# EAGLE design musicbox (EAGLE 7.2.0)
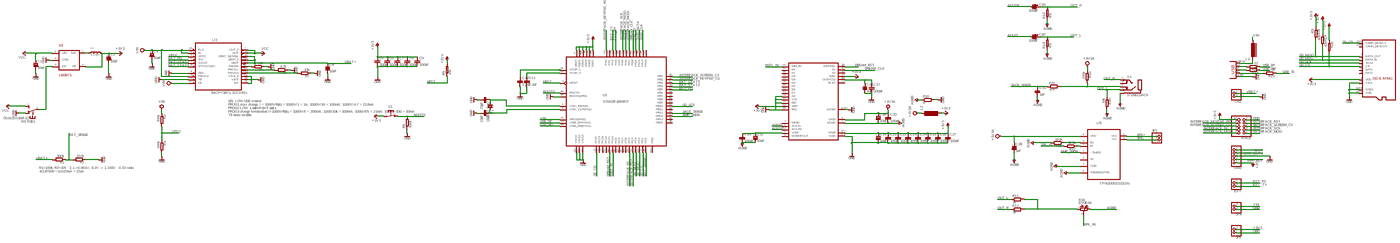
[diagram p0: schematic, sheet 1, overview]
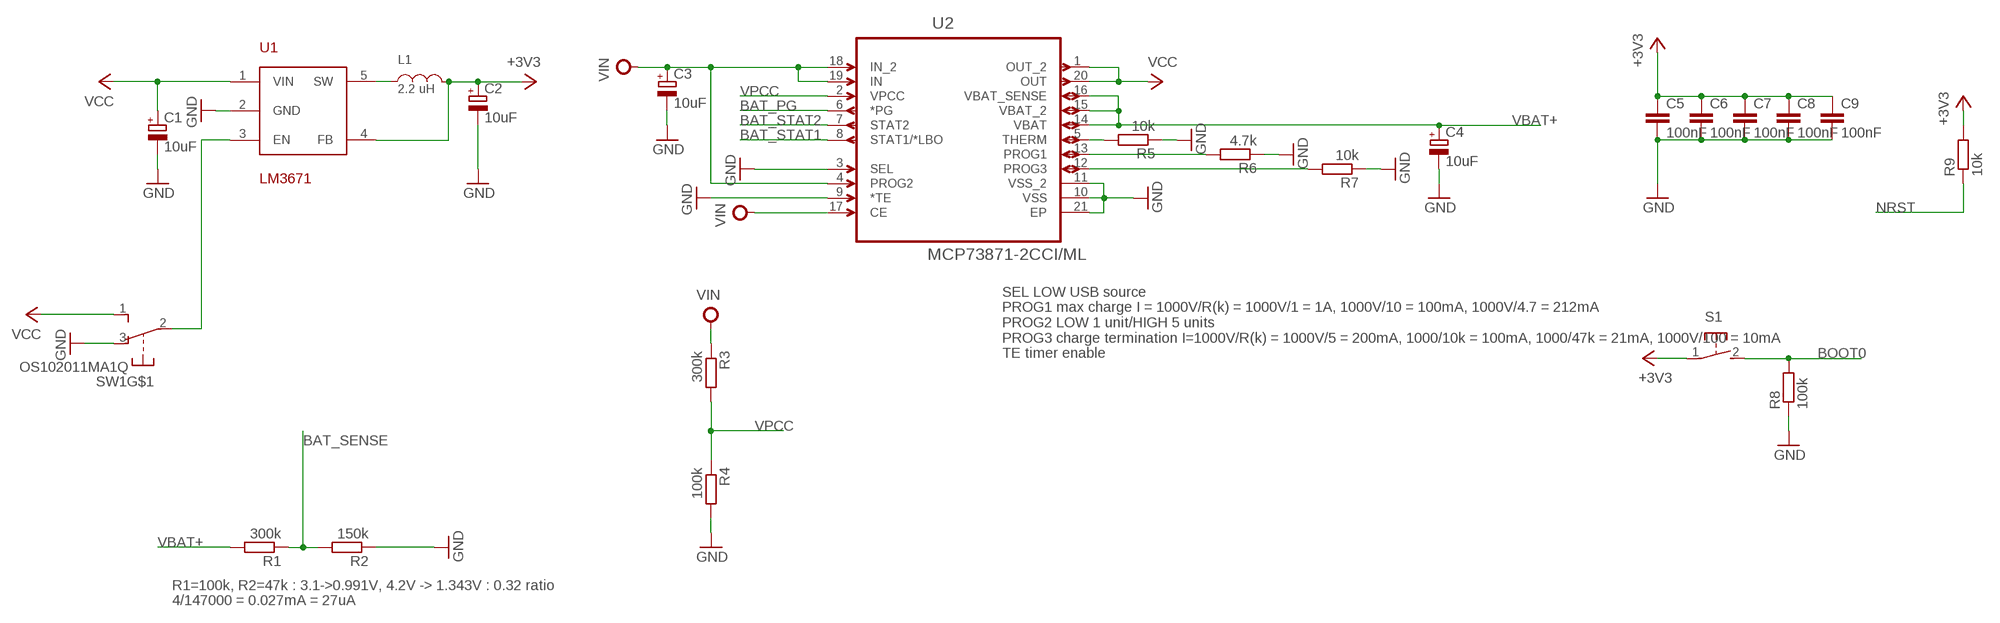
[diagram p1: schematic, sheet 1, part 1 of 4]
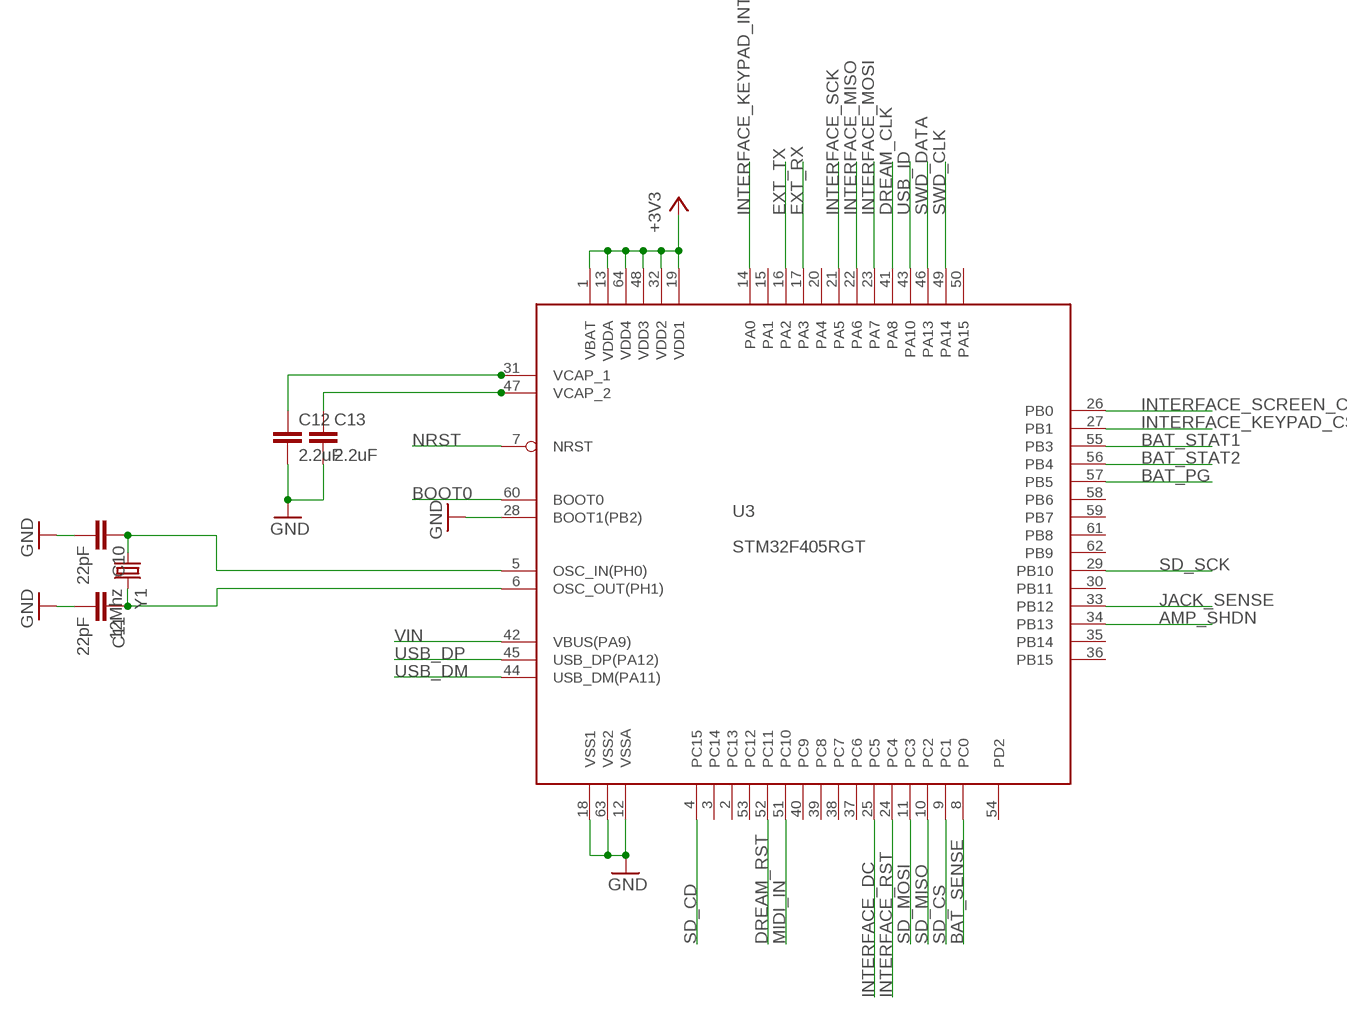
[diagram p2: schematic, sheet 1, part 2 of 4]
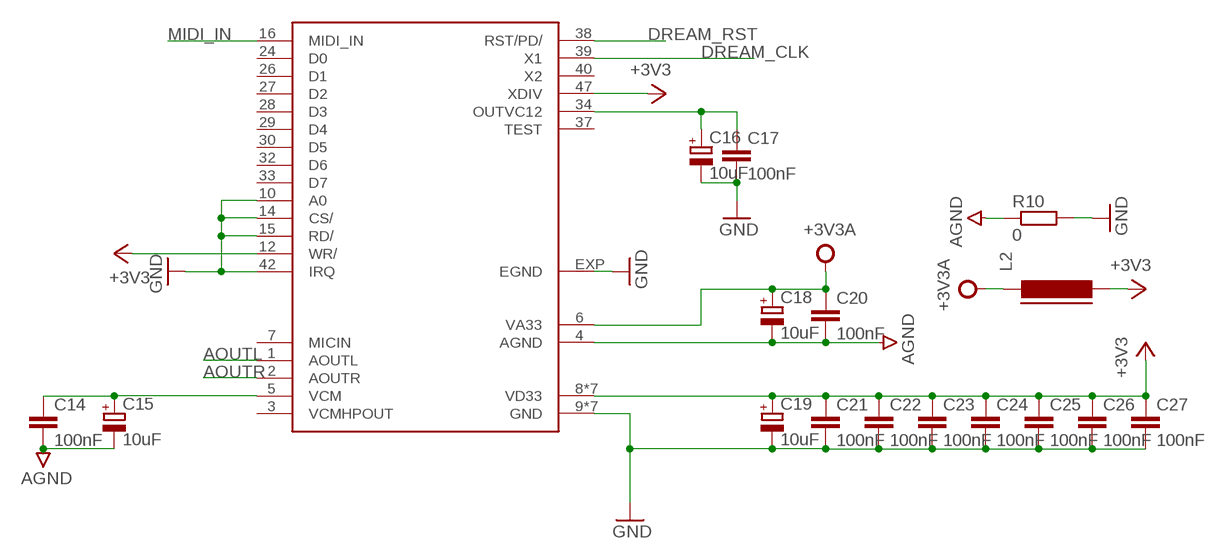
[diagram p3: schematic, sheet 1, part 3 of 4]
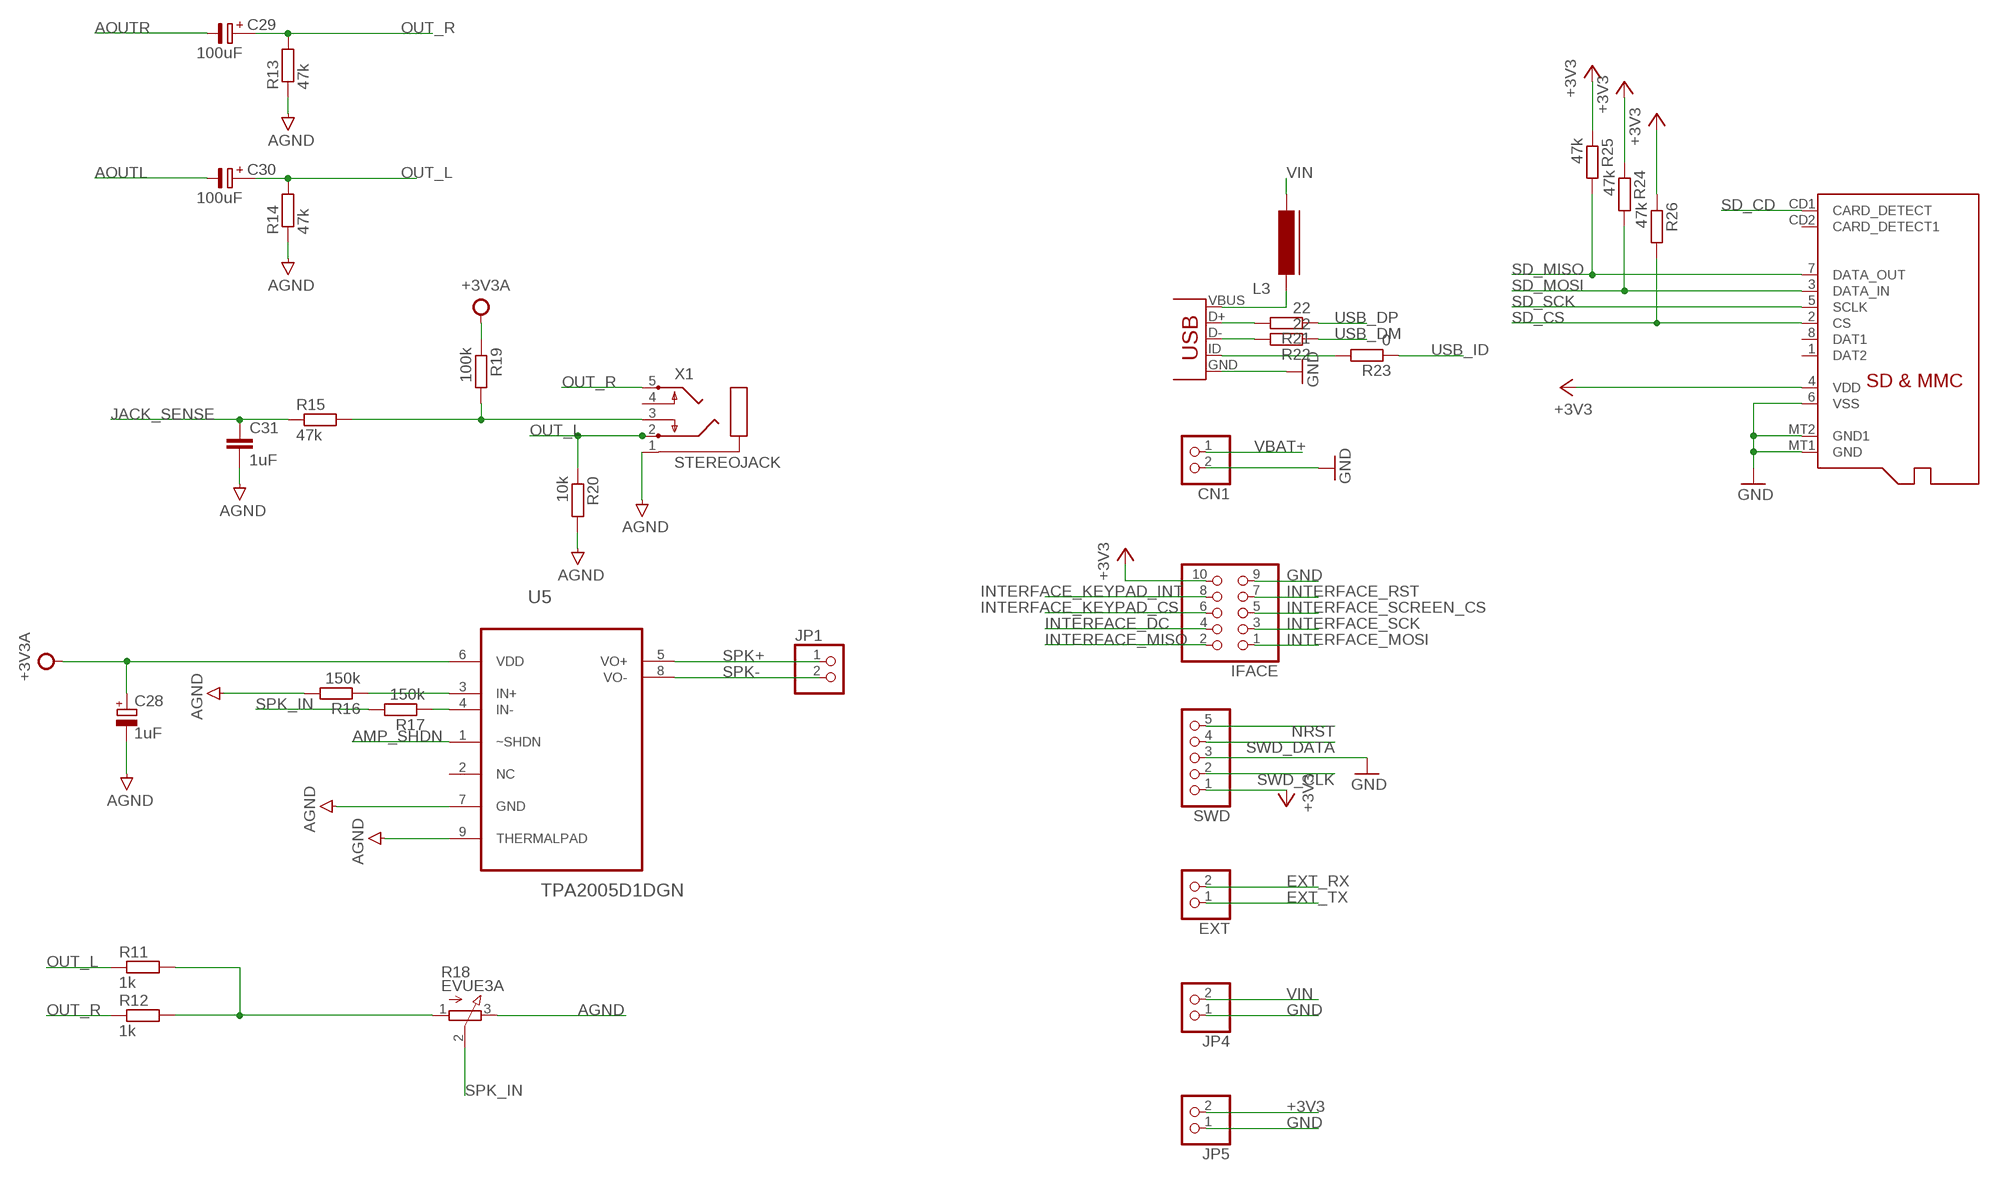
[diagram p4: schematic, sheet 1, part 4 of 4]

## Parts
C1  10uF  CPOL-EUA/3216-18R  [A/3216-18R]
C2  10uF  CPOL-EUA/3216-18R  [A/3216-18R]
C3  10uF  CPOL-EUA/3216-18R  [A/3216-18R]
C4  10uF  CPOL-EUA/3216-18R  [A/3216-18R]
C5  100nF  C-EUC0603K  [C0603K]
C6  100nF  C-EUC0603K  [C0603K]
C7  100nF  C-EUC0603K  [C0603K]
C8  100nF  C-EUC0603K  [C0603K]
C9  100nF  C-EUC0603K  [C0603K]
C10  22pF  C-EUC0603K  [C0603K]
C11  22pF  C-EUC0603K  [C0603K]
C12  2.2uF  C-EUC0603K  [C0603K]
C13  2.2uF  C-EUC0603K  [C0603K]
C14  100nF  C-EUC0603K  [C0603K]
C15  10uF  CPOL-EUA/3216-18R  [A/3216-18R]
C16  10uF  CPOL-EUA/3216-18R  [A/3216-18R]
C17  100nF  C-EUC0603K  [C0603K]
C18  10uF  CPOL-EUA/3216-18R  [A/3216-18R]
C19  10uF  CPOL-EUA/3216-18R  [A/3216-18R]
C20  100nF  C-EUC0603K  [C0603K]
C21  100nF  C-EUC0603K  [C0603K]
C22  100nF  C-EUC0603K  [C0603K]
C23  100nF  C-EUC0603K  [C0603K]
C24  100nF  C-EUC0603K  [C0603K]
C25  100nF  C-EUC0603K  [C0603K]
C26  100nF  C-EUC0603K  [C0603K]
C27  100nF  C-EUC0603K  [C0603K]
C28  1uF  CPOL-EUA/3216-18R  [A/3216-18R]
C29  100uF  C-PR-SMD-SV-B  [SV-B]
C30  100uF  C-PR-SMD-SV-B  [SV-B]
C31  1uF  C-EUC0603K  [C0603K]
CN1  JST_2PIN-THM  [JST-PH-2-THM]
EXT  HEADER-1X2ROUND  [1X02_ROUND]
IFACE  HEADER-2X5  [2X05]
JP1  HEADER-1X2ROUND  [1X02_ROUND]
JP4  HEADER-1X2ROUND  [1X02_ROUND]
JP5  HEADER-1X2ROUND  [1X02_ROUND]
L1  2.2 uH  L4X4MM  [4X4MM]
L2  FERRITE-0603  [FB603]
L3  FERRITE-0603  [FB603]
R1  300k  R-EU_R0603  [R0603]
R2  150k  R-EU_R0603  [R0603]
R3  300k  R-EU_R0603  [R0603]
R4  100k  R-EU_R0603  [R0603]
R5  10k  R-EU_R0603  [R0603]
R6  4.7k  R-EU_R0603  [R0603]
R7  10k  R-EU_R0603  [R0603]
R8  100k  R-EU_R0603  [R0603]
R9  10k  R-EU_R0603  [R0603]
R10  0  R-EU_R0603  [R0603]
R11  1k  R-EU_R0603  [R0603]
R12  1k  R-EU_R0603  [R0603]
R13  47k  R-EU_R0603  [R0603]
R14  47k  R-EU_R0603  [R0603]
R15  47k  R-EU_R0603  [R0603]
R16  150k  R-EU_R0603  [R0603]
R17  150k  R-EU_R0603  [R0603]
R18  EVUE3A  [EVUE]
R19  100k  R-EU_R0603  [R0603]
R20  10k  R-EU_R0603  [R0603]
R21  22  R-EU_R0603  [R0603]
R22  22  R-EU_R0603  [R0603]
R23  0  R-EU_R0603  [R0603]
R24  47k  R-EU_R0603  [R0603]
R25  47k  R-EU_R0603  [R0603]
R26  47k  R-EU_R0603  [R0603]
S1  31-XX  [B3F-31XX]
SW1  OS102011MA1Q  [OS102011MA1Q]
SWD  HEADER-1X5ROUND  [1X05_ROUND]
U1  LM3671  [SOT23-5]
U2  MCP73871-2CCI/ML  [QFN50P400X400X100-21N]
U3  STM32F405RGT  [LQFP64]
U4  SAM2695  [QFN48]
U5  TPA2005D1DGN  [SOP65P488X107-9N]
U6  MICROSD  [MICROSD]
X1  STEREOJACK  [STX3100]
X2  USB-MICROB-SMD  [USB-MICROB-SMD]
Y1  12Mhz  CRYSTALTXC-7A  [CRYSTAL-TXC-7A]

## Nets
+3V3 [VCC]: C2.+ C5.1 C6.1 C7.1 C8.1 C9.1 C19.+ C21.1 C22.1 C23.1 C24.1 C25.1 C26.1 C27.1 IFACE.10 JP5.2 L1.2 L2.2 R9.2 R24.1 R25.1 R26.1 S1.1(P) SWD.1 U1.4(FB) U3.1(VBAT) U3.13(VDDA) U3.19(VDD1) U3.32(VDD2) U3.48(VDD3) U3.64(VDD4) U4.8(VD33) U4.11(VD33) U4.12(WR/) U4.20(VD33) U4.31(VD33) U4.35(VD33) U4.41(VD33) U4.46(VD33) U4.47(XDIV) U6.4(VDD)
+3V3A [VCC]: C18.+ C20.1 C28.+ L2.1 R19.1 U4.6(VA33) U5.6(VDD)
AGND [GND]: C14.2 C15.- C18.- C20.2 C28.- C31.2 R10.1 R13.1 R14.1 R16.2 R18.3(E) R20.2 U4.4(AGND) U5.7(GND) U5.9(THERMALPAD) X1.1
AMP_SHDN: U3.34(PB13) U5.1(~SHDN)
AOUTL: C30.- U4.1(AOUTL)
AOUTR: C29.- U4.2(AOUTR)
BAT_PG: U2.6(*PG) U3.57(PB5)
BAT_SENSE: R1.1 R2.2 U3.8(PC0)
BAT_STAT1: U2.8(STAT1/*LBO) U3.55(PB3)
BAT_STAT2: U2.7(STAT2) U3.56(PB4)
BOOT0: R8.2 S1.2(S) U3.60(BOOT0)
DREAM_CLK: U3.41(PA8) U4.39(X1)
DREAM_RST: U3.52(PC11) U4.38(RST/PD/)
EXT_RX: EXT.2 U3.17(PA3)
EXT_TX: EXT.1 U3.16(PA2)
GND [GND]: C1.- C2.- C3.- C4.- C5.2 C6.2 C7.2 C8.2 C9.2 C10.2 C11.2 C12.2 C13.2 C16.- C17.2 C19.- C21.2 C22.2 C23.2 C24.2 C25.2 C26.2 C27.2 CN1.2 IFACE.9 JP4.1 JP5.1 R2.1 R4.2 R5.1 R6.1 R7.1 R8.1 R10.2 SW1.3(O) SWD.3 U1.2(GND) U2.3(SEL) U2.9(*TE) U2.10(VSS) U2.11(VSS_2) U2.21(EP) U3.12(VSSA) U3.18(VSS1) U3.28(BOOT1(PB2)) U3.63(VSS2) U4.9(GND) U4.10(A0) U4.13(GND) U4.14(CS/) U4.15(RD/) U4.18(GND) U4.25(GND) U4.36(GND) U4.42(IRQ) U4.45(GND) U4.48(GND) U4.EXP(EGND) U6.6(VSS) U6.MT1(GND) U6.MT2(GND1) X2.GND
INTERFACE_DC: IFACE.4 U3.25(PC5)
INTERFACE_KEYPAD_CS: IFACE.6 U3.27(PB1)
INTERFACE_KEYPAD_INT: IFACE.8 U3.14(PA0)
INTERFACE_MISO: IFACE.2 U3.22(PA6)
INTERFACE_MOSI: IFACE.1 U3.23(PA7)
INTERFACE_RST: IFACE.7 U3.24(PC4)
INTERFACE_SCK: IFACE.3 U3.21(PA5)
INTERFACE_SCREEN_CS: IFACE.5 U3.26(PB0)
JACK_SENSE: C31.1 R15.1 U3.33(PB12)
MIDI_IN: U3.51(PC10) U4.16(MIDI_IN)
N$2: C12.1 U3.31(VCAP_1)
N$3: C11.1 U3.6(OSC_OUT(PH1)) Y1.P$2
N$4: C10.1 U3.5(OSC_IN(PH0)) Y1.P$1
N$5: C16.+ C17.1 U4.34(OUTVC12)
N$6: C14.1 C15.+ U4.5(VCM)
N$7: R21.2 X2.D+
N$8: C13.1 U3.47(VCAP_2)
N$9: L1.1 U1.5(SW)
N$10: R22.2 X2.D-
N$11: SW1.2(P) U1.3(EN)
N$12: R23.2 X2.ID
N$14: R5.2 U2.5(THERM)
N$15: L3.1 X2.VBUS
N$16: R7.2 U2.12(PROG3)
N$17: R6.2 U2.13(PROG1)
N$18: R11.2 R12.2 R18.1(A)
N$19: R17.1 U5.4(IN-)
N$20: R16.1 U5.3(IN+)
N$22: R15.2 R19.2 X1.3
NRST: R9.1 SWD.5 U3.7(NRST)
OUT_L: C30.+ R11.1 R14.2 R20.1 X1.2
OUT_R: C29.+ R12.1 R13.2 X1.5
SD_CD: U3.4(PC15) U6.CD1(CARD_DETECT)
SD_CS: R26.2 U3.9(PC1) U6.2(CS)
SD_MISO: R25.2 U3.10(PC2) U6.7(DATA_OUT)
SD_MOSI: R24.2 U3.11(PC3) U6.3(DATA_IN)
SD_SCK: U3.29(PB10) U6.5(SCLK)
SPK+: JP1.1 U5.5(VO+)
SPK-: JP1.2 U5.8(VO-)
SPK_IN: R17.2 R18.2(S)
SWD_CLK: SWD.2 U3.49(PA14)
SWD_DATA: SWD.4 U3.46(PA13)
USB_DM: R22.1 U3.44(USB_DM(PA11))
USB_DP: R21.1 U3.45(USB_DP(PA12))
USB_ID: R23.1 U3.43(PA10)
VBAT+ [VCC]: C4.+ CN1.1 R1.2 U2.14(VBAT) U2.15(VBAT_2) U2.16(VBAT_SENSE)
VCC [VCC]: C1.+ SW1.1(S) U1.1(VIN) U2.1(OUT_2) U2.20(OUT)
VIN [VBUS]: C3.+ JP4.2 L3.2 R3.1 U2.4(PROG2) U2.17(CE) U2.18(IN_2) U2.19(IN) U3.42(VBUS(PA9))
VPCC [VBUS]: R3.2 R4.1 U2.2(VPCC)
Unconnected: SW1.MT1(MT) SW1.MT2(MT) U3.2(PC13) U3.3(PC14) U3.15(PA1) U3.20(PA4) U3.30(PB11) U3.35(PB14) U3.36(PB15) U3.37(PC6) U3.38(PC7) U3.39(PC8) U3.40(PC9) U3.50(PA15) U3.53(PC12) U3.54(PD2) U3.58(PB6) U3.59(PB7) U3.61(PB8) U3.62(PB9) U4.3(VCMHPOUT) U4.7(MICIN) U4.24(D0) U4.26(D1) U4.27(D2) U4.28(D3) U4.29(D4) U4.30(D5) U4.32(D6) U4.33(D7) U4.37(TEST) U4.40(X2) U5.2(NC) U6.1(DAT2) U6.8(DAT1) U6.CD2(CARD_DETECT1) X1.4 X2.MT1 X2.MT2 X2.MT3 X2.MT4

## Notes on the sheet
- SEL LOW USB source
  PROG1 max charge I = 1000V/R(k) = 1000V/1 = 1A, 1000V/10 = 100mA, 1000V/4.7 = 212mA
  PROG2 LOW 1 unit/HIGH 5 units
  PROG3 charge termination I=1000V/R(k) = 1000V/5 = 200mA, 1000/10k = 100mA, 1000/47k = 21mA, 1000V/100 = 10mA
  TE timer enable
- R1=100k, R2=47k : 3.1->0.991V, 4.2V -> 1.343V : 0.32 ratio
  4/147000 = 0.027mA = 27uA

## Library data of the parts
C1-C4 C15 C16 C18 C19 C28 = rcl:CPOL-EU: POLARIZED CAPACITOR, European symbol
C5-C14 C17 C20-C27 C31 = rcl:C-EU: CAPACITOR, European symbol
C29 C30 = cap-pan40:C-PR: POLARIZED ELECTROLYTIC/TANTALUM
CN1 = adafruit:JST_2PIN: JST 2-Pin Connectors of various flavors SMT-RA (S2B-PH-SM4) 4UConnector #17311 SMT (B2B-PH-SM4) THM-RA (S2B-PH) THM (B2B-PH)
EXT JP1 JP4 JP5 = microbuilder:HEADER-1X2: PIN HEADER
IFACE = header2x5:HEADER-2X5: PIN HEADER
L1 = inductors:L
L2 L3 = dp_devices:FERRITE: Ferrite bead in various packages
R1-R17 R19-R26 = rcl:R-EU_: RESISTOR, European symbol
R18 = pot:EVU: 9 mm Square Rotary Potentiometers Source: Panasonic
S1 = switch-omron:31-XX: OMRON SWITCH; MPN: B3F-3100; OC_FARNELL: 959704; OC_NEWARK: 36M3582
SW1 = adafruit:OS102011MA1Q: OS10201MA1Q through-hole right angle switch http://www.ladyada.net/library/eagle
SWD = microbuilder:HEADER-1X5: PIN HEADER
U1 = texas-custom:LM3671: Texas Instruments LM3671, LM3671Q 2MHz, 600mA Step-Down DC-DC Converter
U2 = Microchip_By_element14_Batch_1:MCP73871-2CCI/ML: IC, BATTERY CHARGER, 1A; MPN: MCP73871-2CCI/ML; OC_FARNELL: 1642489; OC_NEWARK: 54M4957; PACKAGE: QFN-20; SUPPLIER: Microchip
U3 = stm32f4stamp:STM32F405RGT
U4 = sam2695:SAM2695
U5 = Texas Instruments_By_element14_Batch_1:TPA2005D1DGN: 1.4-W MONO FILTER-FREE CLASS-D AUDIO POWER AMPLIFIER; MPN: TPA2005D1DGN; OC_FARNELL: 1695462; OC_NEWARK: 73J8370; PACKAGE: MSOP-8; SUPPLIER: Texas Instruments
U6 = adafruit:MICROSD: Micro-SD / Transflash card holder with SPI pinout For the 3M # 2908-05WB-MG and/or 4UCON #19656 push-push type
X1 = adafruit:STEREOJACK: MIC/HEADPHONE JACK Stereo jack with two switches. Kycon STX3100, CUI SJ1-3555NG and/or 4UCon 05544
X2 = stm32f4stamp:USB: USB Connectors USB-B-PTH is fully proven SKU : PRT-00139 USB-miniB is fully proven SKU : PRT-00587 USB-A-PCB is untested. USB-A-H is throughly reviewed, but untested. Spark Fun Electronics SKU : PRT-00437 USB-B-SMT is throughly reviewed, but untested. Needs silkscreen touching up. USB-A-S has not been used/tested USB-MB-H has not been used/tested
Y1 = SparkFun-FreqCtrl:CRYSTAL: Various standard crystals. Proven footprints. Spark Fun Electronics SKU : COM-00534

## Net classes
1 GND: width 0.305 mm
2 VCC: width 0.305 mm
3 VBUS: width 0.508 mm

## Board
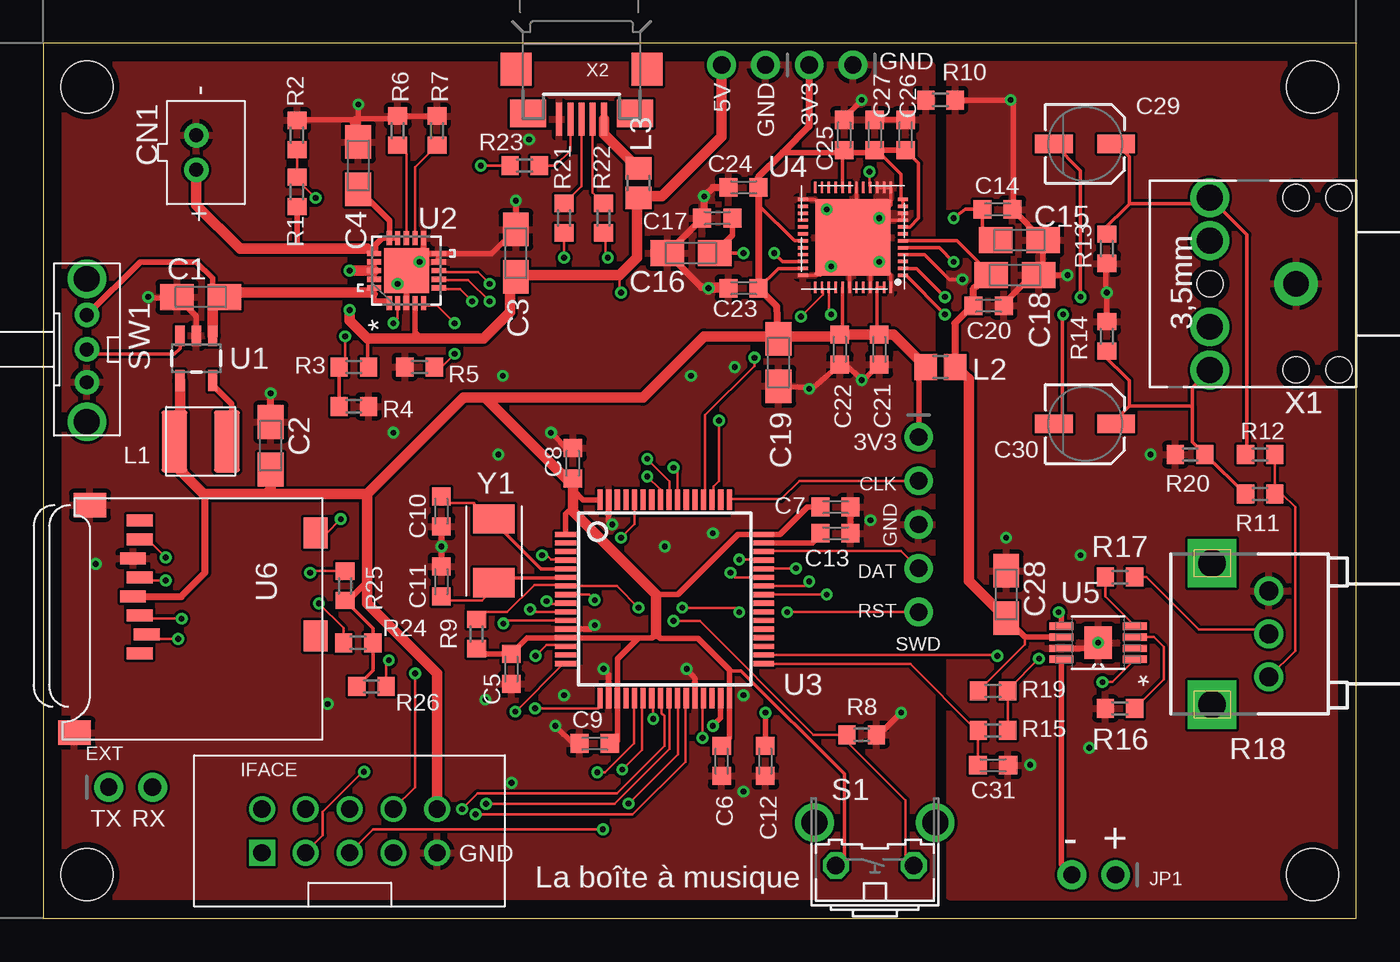
[diagram p5: board, top side]
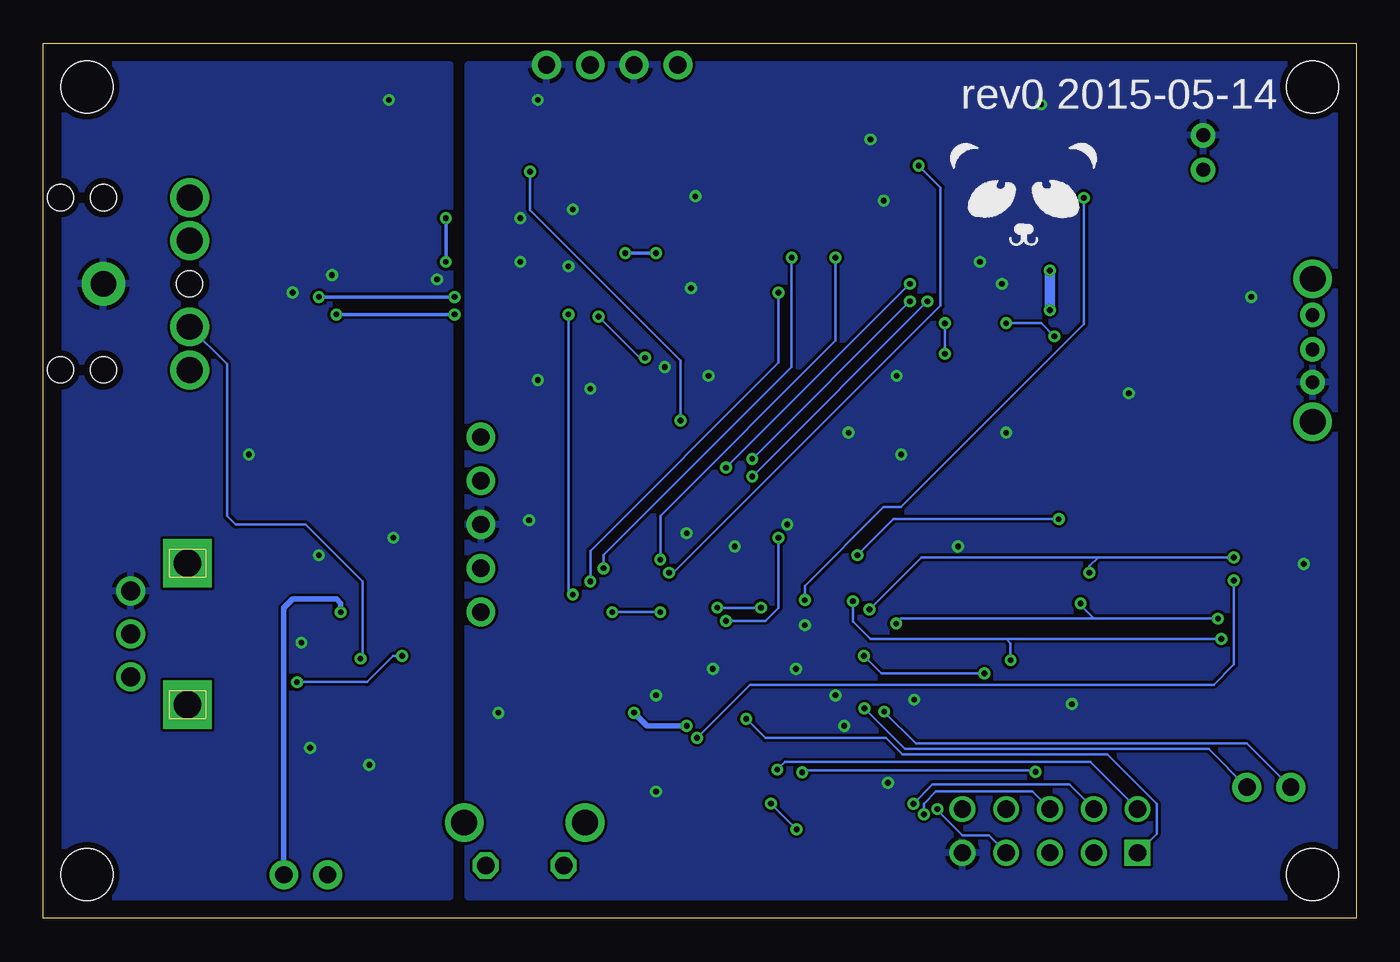
[diagram p6: board, bottom side, seen from below]

Size 76.2 x 50.8 mm. Coordinates in mm from the lower left corner, seen from the top.
Outline: 0,0 76.2,0 76.2,50.8 0,50.8 0,0
Copper layers (1*16): Top 0.0356mm / dielectric 1.5011mm / Bottom 0.0356mm
Design rules "oshpark-2layer": minimum track width 6mil, minimum drill 13mil, track to track 6mil, track to pad 6mil, pad to pad 6mil, via to via 6mil, smd to smd 6mil, copper to edge 15mil, drill to drill 6mil, minimum pad ring 7mil, minimum via ring 7mil, stop-mask expansion 4mil, vias tented up to drill 0mil, thermal gap 10mil
Holes 3 mm at 2.54,48.26 73.66,48.26 73.66,2.54 2.54,2.54

### Footprints (pad centres in the part's own frame; a part is rotated, then mirrored left to right if it is on the bottom)
A/3216-18R = smd 1.95 x 1.5: + 1.375,0; - -1.375,0
C0603K = smd 1.05 x 1.08: 1 -0.875,0; 2 0.875,0
SV-B = smd 2.184 x 1.067: + -1.81,0; - 1.81,0
JST-PH-2-THM = drill 0.8 pad 1.422: 1 1,0; 2 -1,0
1X02_ROUND = drill 1 pad 1.676: 1 -1.27,0; 2 1.27,0
2X05 = drill 1 square: 1 -5.08,-1.27 | drill 1: 2 -5.08,1.27; 3 -2.54,-1.27; 4 -2.54,1.27; 5 0,-1.27; 6 0,1.27; 7 2.54,-1.27; 8 2.54,1.27; 9 5.08,-1.27; 10 5.08,1.27
4X4MM = smd 1.5 x 3.6: 1 -1.525,0; 2 1.525,0
FB603 = smd 1.3 x 1.5: 1 -0.85,0; 2 0.85,0
R0603 = smd 1 x 1.1: 1 -0.85,0; 2 0.85,0
EVUE = drill 1.1 pad 1.676: 1 0,-2.5; 2 0,0; 3 0,2.5 | drill 1.6 pad 2.8 square: M1 -3.3,4.1; M2 -3.3,-4.1
B3F-31XX = drill 1.016 octagon: 1 -2.261,-1.245; 2 2.261,-1.245 | drill 1.499 pad 2.159: 3 -3.505,1.245; 4 3.505,1.245
OS102011MA1Q = drill 0.8 pad 1.422: 1 -2,0; 2 0,0; 3 1.9,0 | drill 1.5 pad 2.184: MT1 -4.1,0; MT2 4.2,0
1X05_ROUND = drill 1 pad 1.676: 1 -5.08,0; 2 -2.54,0; 3 0,0; 4 2.54,0; 5 5.08,0
SOT23-5 = smd 0.55 x 1.2: 1 -0.95,-1.3; 2 0,-1.3; 3 0.95,-1.3; 4 0.95,1.3; 5 -0.95,1.3
QFN50P400X400X100-21N = smd 0.813 x 0.305: 1 -1.88,0.991; 2 -1.88,0.508; 3 -1.88,0; 4 -1.88,-0.508; 5 -1.88,-0.991; 11 1.88,-0.991; 12 1.88,-0.508; 13 1.88,0; 14 1.88,0.508; 15 1.88,0.991 | smd 0.305 x 0.813: 6 -0.991,-1.88; 7 -0.508,-1.88; 8 0,-1.88; 9 0.508,-1.88; 10 0.991,-1.88; 16 0.991,1.88; 17 0.508,1.88; 18 0,1.88; 19 -0.508,1.88; 20 -0.991,1.88 | smd 2.6 x 2.6: 21 0,0
LQFP64 = smd 0.3 x 1.2: 1 -3.75,-5.75; 2 -3.25,-5.75; 3 -2.75,-5.75; 4 -2.25,-5.75; 5 -1.75,-5.75; 6 -1.25,-5.75; 7 -0.75,-5.75; 8 -0.25,-5.75; 9 0.25,-5.75; 10 0.75,-5.75; 11 1.25,-5.75; 12 1.75,-5.75; 13 2.25,-5.75; 14 2.75,-5.75; 15 3.25,-5.75; 16 3.75,-5.75; 33 3.75,5.75; 34 3.25,5.75; 35 2.75,5.75; 36 2.25,5.75; 37 1.75,5.75; 38 1.25,5.75; 39 0.75,5.75; 40 0.25,5.75; 41 -0.25,5.75; 42 -0.75,5.75; 43 -1.25,5.75; 44 -1.75,5.75; 45 -2.25,5.75; 46 -2.75,5.75; 47 -3.25,5.75; 48 -3.75,5.75 | smd 1.2 x 0.3: 17 5.75,-3.75; 18 5.75,-3.25; 19 5.75,-2.75; 20 5.75,-2.25; 21 5.75,-1.75; 22 5.75,-1.25; 23 5.75,-0.75; 24 5.75,-0.25; 25 5.75,0.25; 26 5.75,0.75; 27 5.75,1.25; 28 5.75,1.75; 29 5.75,2.25; 30 5.75,2.75; 31 5.75,3.25; 32 5.75,3.75; 49 -5.75,3.75; 50 -5.75,3.25; 51 -5.75,2.75; 52 -5.75,2.25; 53 -5.75,1.75; 54 -5.75,1.25; 55 -5.75,0.75; 56 -5.75,0.25; 57 -5.75,-0.25; 58 -5.75,-0.75; 59 -5.75,-1.25; 60 -5.75,-1.75; 61 -5.75,-2.25; 62 -5.75,-2.75; 63 -5.75,-3.25; 64 -5.75,-3.75
QFN48 = smd 0.65 x 0.2: 1 -2.9,2.3; 2 -2.9,1.9; 3 -2.9,1.5; 4 -2.9,1.1; 5 -2.9,0.7; 6 -2.9,0.3; 7 -2.9,-0.1; 8 -2.9,-0.5; 9 -2.9,-0.9; 10 -2.9,-1.3; 11 -2.9,-1.7; 12 -2.9,-2.1; 25 2.9,-2.1; 26 2.9,-1.7; 27 2.9,-1.3; 28 2.9,-0.9; 29 2.9,-0.5; 30 2.9,-0.1; 31 2.9,0.3; 32 2.9,0.7; 33 2.9,1.1; 34 2.9,1.5; 35 2.9,1.9; 36 2.9,2.3 | smd 0.2 x 0.65: 13 -2.2,-2.8; 14 -1.8,-2.8; 15 -1.4,-2.8; 16 -1,-2.8; 17 -0.6,-2.8; 18 -0.2,-2.8; 19 0.2,-2.8; 20 0.6,-2.8; 21 1,-2.8; 22 1.4,-2.8; 23 1.8,-2.8; 24 2.2,-2.8; 37 2.2,3; 38 1.8,3; 39 1.4,3; 40 1,3; 41 0.6,3; 42 0.2,3; 43 -0.2,3; 44 -0.6,3; 45 -1,3; 46 -1.4,3; 47 -1.8,3; 48 -2.2,3 | smd 4.4 x 4.4: EXP 0,0.1
SOP65P488X107-9N = smd 1.397 x 0.432: 1 -2.134,0.965; 2 -2.134,0.33; 3 -2.134,-0.33; 4 -2.134,-0.965; 5 2.134,-0.965; 6 2.134,-0.33; 7 2.134,0.33; 8 2.134,0.965 | smd 1.575 x 1.88: 9 0,0
MICROSD = smd 0.7 x 1.5: 1 9,-10.64; 2 7.9,-10.24; 3 6.8,-10.64; 4 5.7,-11.04; 5 4.6,-10.64; 6 3.5,-11.04; 7 2.4,-10.64; 8 1.3,-10.64 | smd 1.8 x 1.4: CD1 2,-0.44; CD2 8,-0.44 | smd 1.4 x 1.9: MT1 0.4,-13.54; MT2 13.6,-14.44
STX3100 = drill 1.5 pad 2.54: 1 3.5,0 | drill 1.5: 2 8.5,5; 3 8.5,2.5; 4 8.5,-2.5; 5 8.5,-5 | hole 1.5: 3.5,5; 3.5,-5; 8.5,0; 1,5; 1,-5
USB-MICROB-SMD = smd 0.35 x 1.9: D+ 0,2.9; D- -0.65,2.9; GND 1.3,2.9; ID 0.65,2.9; VBUS -1.3,2.9 | smd 1.8 x 1.9: MT1 -3.8,0; MT2 3.8,0 | smd 2.1 x 1.6: MT3 -3.1,2.55; MT4 3.1,2.55
CRYSTAL-TXC-7A = smd 1.7 x 2.4: P$1 1.85,0; P$2 -1.85,0

### Placement (x,y rotation side)
C1  9.14,36.07 0 top
C2  13.21,27.43 270 top
C3  27.43,38.61 270 top
C4  18.29,43.69 270 top
C5  27.18,14.48 270 top
C6  39.37,9.14 270 top
C7  45.97,23.88 0 top
C8  30.73,26.42 90 top
C9  32,10.16 180 top
C10  23.11,23.62 270 top
C11  23.11,19.56 90 top
C12  41.91,9.14 270 top
C13  45.97,22.35 0 top
C14  55.37,41.15 0 top
C15  56.64,39.37 180 top
C16  37.59,38.61 0 top
C17  39.12,40.64 180 top
C18  56.39,37.34 180 top
C19  42.67,32.26 90 top
C20  54.86,35.56 0 top
C21  48.51,33.02 270 top
C22  46.23,33.02 270 top
C23  40.64,36.58 180 top
C24  40.64,42.42 180 top
C25  46.48,45.47 90 top
C26  50.04,45.47 90 top
C27  48.26,45.47 90 top
C28  55.88,18.8 270 top
C29  60.45,44.96 180 top
C30  60.45,28.7 180 top
C31  55.12,8.89 0 top
CN1  8.89,44.45 270 top
EXT  5.08,7.62 0 top
IFACE  17.78,5.08 0 top
JP1  60.96,2.54 180 top
JP4  40.64,49.53 180 top
JP5  45.72,49.53 180 top
L1  9.14,27.69 180 top
L2  52.07,32 180 top
L3  34.54,42.67 270 top
R1  14.73,42.16 270 top
R2  14.73,45.47 270 top
R3  18.03,32 180 top
R4  18.03,29.72 0 top
R5  21.84,32 0 top
R6  20.57,45.72 270 top
R7  22.86,45.72 270 top
R8  47.5,10.67 180 top
R9  25.15,16.51 270 top
R10  52.07,47.5 180 top
R11  70.61,24.64 0 top
R12  70.61,26.92 0 top
R13  61.72,38.86 90 top
R14  61.72,33.78 270 top
R15  55.12,10.92 0 top
R16  62.48,12.19 180 top
R17  62.48,19.81 0 top
R18  71.12,16.51 0 top
R19  55.12,13.21 0 top
R20  66.55,26.92 180 top
R21  30.23,40.64 90 top
R22  32.51,40.64 90 top
R23  27.94,43.69 0 top
R24  18.29,16 180 top
R25  17.53,19.3 90 top
R26  19.05,13.46 0 top
S1  48.26,4.32 0 top
SW1  2.54,33.02 270 top
SWD  50.8,22.86 270 top
U1  8.89,32.51 180 top
U2  21.08,37.59 90 top
U3  36.07,18.54 270 top
U4  46.99,39.62 180 top
U5  61.21,16 180 top
U6  16.26,24.38 270 top
U$1  [PANDA]  19.3,41.15 0 bottom
X1  76.2,36.83 180 top
X2  31.24,49.28 180 top
Y1  26.16,21.34 90 top

### Tracks (layer width: path | path; a pad name or v marks a point on that pad's centre or on a via)
+3V3
  Top 0.203: U4.47 U4.46 48.39,34.02 C21.1 | U4.11 U4.12 49.78,41.83 49.78,43.18 48.51,44.45 C27.1 | U4.31 43.59,39.32 41.52,41.4 | U4.35 42.66,37.72 C23.1 | U4.20 46.39,44.43 C25.1 | U4.8 50.28,40.12 50.8,40.64 50.8,43.83 C26.1 | U4.41 46.39,34.06 C22.1 | S1.1 46.48,3.3 46.48,8.38 40.49,14.38 39.88,14.38 39.82,14.44 | R25.1 19.14,16.84 R24.1 19.14,14.4 R26.1
  Top 0.305: C26.1 C27.1 48.4,44.45 46.23,44.45 | C22.1 46.26,34.09 46.26,34.05 | C21.1 48.24,34.09 48.24,34.05 | C9.1 33.32,10.32 U3.19 33.32,15.06 34.54,16.29 | 42.93,44.45 46.23,44.45 | C25.1 46.23,44.45 | C19.+ 42.67,33.78 | C6.1 39.82,10.47 U3.32 39.82,14.44 38,16.26 35.81,16.26 35.56,16.51 35.34,16.29 34.54,16.29 | SWD.1 50.83,27.99 50.83,31.42 51.13,31.73 L2.2 | 35.56,18.8 36.83,18.8 40.33,22.29 U3.48 42.75,22.29 44.34,23.88 C7.1 | 34.54,16.29 31.91,16.29 U3.13 28.09,16.29 C5.1 25.35,15.35 R9.2 | U3.64 31.33,24.29 30.73,24.89 | U3.1 30.32,23.46 30.73,23.88 | 18.8,19.56 17.61,18.38 17.61,18.29 17.36,18.29 R25.1 | 41.69,36.3 41.69,36.52 C23.1 41.62,36.37 41.69,36.3
  Top 0.406: C21.1 48.24,34.05 | C19.+ 42.57,35.51 41.62,36.46 C23.1 41.52,41.4 C24.1 41.52,43.04 42.93,44.45 44.45,45.97 JP5.2 | U6.4 8.02,18.68 9.4,20.07 9.4,24.64 | C8.1 30.73,24.89 | 30.73,23.88 30.73,23.62
  Top 0.61: 7.83,28.18 7.75,28.02 | 7.75,28.02 L1.2 7.43,26.51 9.3,24.64 9.4,24.64 12.95,24.64 | 12.95,24.64 18.8,24.64 | 25.65,30.23 34.8,30.23 38.35,33.78 42.67,33.78 46.12,33.78 C22.1 C21.1 49.33,33.9 L2.2 | 25.65,30.23 24.38,30.23 18.8,24.64 | 43.07,34.05 C19.+ | U1.4 7.94,28.34 7.75,28.02 | 30.73,23.62 35.56,18.8 35.56,16.51 | C2.+ 13.21,24.89 12.95,24.64 | C8.1 30.34,25.54 25.65,30.23 | 30.73,24.89 30.73,23.88 | IFACE.10 22.86,14.22 18.8,18.29 18.8,19.56 18.8,24.64
+3V3A
  Top 0.152: 56.97,16.33 56.97,15.91 R19.1
  Top 0.203: U4.6 53.03,39.32 C18.+
  Top 0.305: 52.89,31.95 L2.1 | 53.8,35.46 C20.1 | 55.3,18.01 C28.+ 56.97,16.33 U5.6
  Top 0.406: 52.89,31.95 52.89,34.54 53.8,35.46 | C20.1 53.99,36.57 C18.+
  Top 0.61: 55.3,18.01 53.72,19.58 53.72,31.29 L2.1
AGND  (via drill 0.33)
  Top 0.203: U4.4 51.14,38.52 52.58,37.08 v53.34,37.08
  Top 0.305: C20.2 55.65,35.7 | R10.1 56.06,47.48 56.29,47.24 56.29,41.29 C14.2 56.28,41.14 C15.- 58.02,37.59 C18.- | 61.42,34.85 R14.1 | R13.1 61.67,38.08 61.67,36.37 v61.72,36.32 R14.1 | 61.34,34.7 R14.1 | C18.- v59.44,37.34 59.51,37.21 | U5.7 60.88,15.67 U5.9 | C18.- 57.4,37.34 55.63,35.56 55.63,35.81
  other vias: 61.21,16 57.28,8.92 56.13,47.5 55.88,22.1 64.26,26.92 60.71,9.91 60.2,21.08
  pour Bottom: 52.58,49.53 74.93,49.53 74.93,1.27 52.58,1.27
  pour Top: 52.58,1.27 74.93,1.27 74.93,49.53 52.58,49.53
AMP_SHDN  (via drill 0.33)
  Top 0.152: U3.34 55.32,15.29 v55.37,15.24 | 63.25,14.94 U5.1 62.03,13.72 v61.47,13.72
  Bottom 0.152: v55.37,15.24 55.88,15.24 57.4,13.72 v61.47,13.72
AOUTL  (via drill 0.33)
  Top 0.152: 59.13,29.01 C30.- | 59.13,35 v59.18,35.05
  Top 0.203: U4.1 50.05,37.32 v52.32,35.05 | 59.13,35 59.13,29.01
  Bottom 0.203: v52.32,35.05 v59.18,35.05
AOUTR  (via drill 0.33)
  Top 0.203: U4.2 50.67,37.72 v52.32,36.07 | v60.2,36.07 60.2,43.4 C29.-
  Bottom 0.203: v52.32,36.07 v60.2,36.07
BAT_PG  (via drill 0.33)
  Top 0.152: U2.6 23.02,36.52 24.18,36.52 v24.89,35.81 | U3.57 35.82,24.33 35.82,24.88 v35.05,25.65
  Bottom 0.152: v35.05,25.65 v24.89,35.81
BAT_SENSE  (via drill 0.33)
  Top 0.152: R2.2 R1.1 14.61,43.02 v15.81,41.81 | U3.8 31.69,18.79 v32,18.48
  Bottom 0.152: v15.81,41.81 15.81,34.48 26.42,23.88 27.43,23.88 32,19.3 v32,18.48
BAT_STAT1  (via drill 0.33)
  Top 0.152: v25.91,36.83 25.23,37.52 23.02,37.52 U2.8 | U3.55 36.81,24.33 36.81,25.93 v36.58,26.16
  Bottom 0.152: v36.58,26.16 v25.91,36.83
BAT_STAT2  (via drill 0.33)
  Top 0.152: U2.7 23.02,37.06 24.66,37.06 v25.91,35.81 | U3.56 36.35,24.33 36.35,25.37 v35.05,26.67
  Bottom 0.152: v25.91,35.81 v35.05,26.67
BOOT0  (via drill 0.33)
  Top 0.152: U3.60 34.32,22.89 v33.53,22.1 | v36.58,17.27 38.1,17.27 44.7,10.67 R8.2 46.71,10.62 46.71,10.19 50.04,6.86 50.04,3.56 S1.2
  Bottom 0.152: v33.53,22.1 33.53,18.03 34.29,17.27 v36.58,17.27
DREAM_CLK  (via drill 0.33)
  Top 0.152: U3.41 45.37,18.79 v45.47,18.8 | U4.39 45.59,35.18 v45.72,35.05
  Bottom 0.152: v45.47,18.8 45.72,19.05 v45.72,35.05
DREAM_RST  (via drill 0.33)
  Top 0.152: v43.97,34.92 45.24,36.2 45.24,36.51 U4.38 | v41.27,32.54 41.27,32.07 38.42,29.21 38.42,24.45 U3.52
  Bottom 0.152: v43.97,34.92 41.59,32.54 v41.27,32.54
EXT_RX  (via drill 0.33)
  Top 0.152: v28.54,12.19 32.23,12.19 U3.17
  Bottom 0.152: v28.54,12.19 26.19,9.84 8.57,9.84 EXT.2
EXT_TX  (via drill 0.33)
  Top 0.152: v27.4,12 30.16,14.76 U3.16
  Bottom 0.152: v27.4,12 25.56,10.16 6.35,10.16 EXT.1
GND  (via drill 0.33)
  Top 0.203: U4.10 U4.9 48.54,40.52 v48.51,40.64 | v48.51,40.64 48.51,40.73 48.8,40.44 | 48.11,37.79 v48.51,38.1 | U4.36 45.1,37.32 v45.72,37.85 | U4.45 47.99,37.67 | 47.99,37.67 v48.51,38.1 | U4.42 46.79,37.65 46.99,37.85 47.81,37.85 47.99,37.67 | v48.51,40.64 49.19,41.41 U4.13 U4.14 U4.15 | U4.18 47.19,41.28 47.75,40.72 | U4.25 44.8,41.72 v45.47,41.15 | U4.48 49.19,37.33 v48.51,38.1
  Top 0.305: R7.1 R6.1 20.43,46.42 18.1,46.42 C4.- | C27.2 C26.2 | C19.- 44.36,30.8 | 44.36,30.8 44.7,30.8 C22.2 46.59,32.15 v47.5,31.24 47.61,31.24 C21.2 | U4.EXP 47.4,40.72 47.75,40.72 48.4,40.72 v48.51,40.64 | C25.2 46.23,46.23 v47.5,47.5 | U2.3 U2.21 20.95,36.83 v20.57,36.83 | v27.43,41.66 C3.- 26.03,38.58 U2.10 | v6.1,36.07 6.58,36 C1.- 8.89,34.95 U1.2 | C4.- 18.32,44.83 v18.29,47.24 | 38.72,36.6 v38.61,36.58 | C10.2 v23.11,21.59 C11.2 | v44.45,30.73 44.36,30.8 | 46.84,22.15 C13.2 | R8.1 48.57,10.74 48.59,10.74 v49.78,11.94 | 30.72,26.97 30.68,26.97 30.53,27.13 | 30.53,27.13 v29.46,28.19 | U3.63 32.82,23.06 v33.02,22.86 | U3.18 32.82,14.17 v32.51,14.48 | U3.28 37.82,13.94 v37.34,14.48 | C8.2 30.71,27.23 30.63,27.23 30.53,27.13 | R2.1 14.48,46.35 17.91,46.35 C4.- | U3.12 31.78,16.79 v32,17.02 | U2.10 22.12,38.58 22.07,38.63 U2.11 | U2.9 U2.10 | 20.8,32.19 20.95,32.18 R5.1 | C9.2 30.73,10.16 v29.72,11.18 | C7.2 C13.2
  Top 0.406: 20.8,32.19 20.73,32.26 | 38.7,36.58 38.7,36.64 38.19,36.64 C16.- | C16.- 36.73,38.76 36.83,38.86 | 38.24,40.89 C17.2 37.99,40.38 C16.- | C24.2 38.86,42.42 v38.35,41.91 38.35,40.64 | 20.8,31.81 R5.1 | C2.- v13.21,30.48
  Top 0.61: 38.61,36.49 38.7,36.58 | 38.72,36.6 39.74,36.6 C23.2
  other vias: 21.84,38.1 26.67,31.5 48.01,23.11 20.32,28.19 30.23,12.95 40.64,7.37 38.86,22.35 3.05,20.57 28.19,45.21 36.07,21.59 40.13,32 37.59,31.5 40.64,12.95 25.65,12.7 26.42,26.92 16.51,12.45 27.18,7.87
  pour Bottom: 1.27,49.53 51.56,49.53 51.56,1.27 1.27,1.27
  pour Top: 1.27,49.53 51.56,49.53 51.56,1.27 1.27,1.27
INTERFACE_DC  (via drill 0.33)
  Top 0.152: v25.7,6.66 33.15,6.66 36.35,9.86 36.35,12.75 U3.25
  Bottom 0.152: v25.7,6.66 24.59,7.77 16.66,7.77 IFACE.4
INTERFACE_KEYPAD_CS  (via drill 0.33)
  Top 0.152: v25.09,6.04 34.21,6.04 37.26,9.09 37.26,12.75 U3.27
  Bottom 0.152: v25.09,6.04 25.09,6.66 24.38,7.37 18.8,7.37 IFACE.6
INTERFACE_KEYPAD_INT  (via drill 0.33)
  Top 0.152: v28.57,15.24 29.21,15.88 29.84,15.88 U3.14 | v21.59,14.22 21.59,7.62 IFACE.8
  Bottom 0.152: v28.57,15.24 27.56,14.22 v21.59,14.22
INTERFACE_MISO  (via drill 0.33)
  Top 0.152: v33.6,8.64 34.75,9.78 34.75,12.75 U3.22
  Bottom 0.152: v33.6,8.64 33.15,9.09 15.44,9.09 IFACE.2
INTERFACE_MOSI  (via drill 0.33)
  Top 0.152: v35.4,11.59 35.4,12.7 U3.23
  Bottom 0.152: v35.4,11.59 34.29,10.48 27.3,10.48 26.35,9.53 14.45,9.53 11.59,6.67 11.59,4.92 IFACE.1
INTERFACE_RST  (via drill 0.33)
  Top 0.152: v24.31,6.35 25.22,7.26 33.3,7.26 36.04,10.01 36.04,11.76 35.89,11.91 35.89,12.75 U3.24
  Bottom 0.152: v24.31,6.35 24.31,6.27 22.86,4.83 21.34,4.83 IFACE.7
INTERFACE_SCK  (via drill 0.33)
  Top 0.152: v32.16,8.48 32.61,8.48 34.29,10.16 34.29,12.75 U3.21 | v18.62,8.51 18.54,8.51 16.23,6.2 16.23,4.83 15.24,3.83 IFACE.3
  Bottom 0.152: v32.16,8.48 32,8.59 18.69,8.59 v18.62,8.51
INTERFACE_SCREEN_CS  (via drill 0.33)
  Top 0.152: v33.97,6.67 36.83,9.53 36.83,12.7 U3.26 | v32.48,5.17 19.14,5.17 IFACE.5
  Bottom 0.152: v32.48,5.17 v33.97,6.67
JACK_SENSE
  Top 0.152: C31.1 54.24,10.9 R15.1 54.13,10.95 50.32,14.76 41.91,14.76 U3.33
MIDI_IN  (via drill 0.33)
  Top 0.152: v47.94,43.34 47.94,42.55 U4.16 | v39.21,28.89 39.21,25.4 38.89,25.08 38.89,24.45 U3.51
  Bottom 0.152: v47.94,43.34 47.94,41.12 39.21,32.38 v39.21,28.89
N$2  (via drill 0.33)
  Top 0.305: U3.31 39.32,11.63 v38.86,11.18 | v41.91,11.94 C12.1
  Bottom 0.305: v38.86,11.18 41.15,11.18 v41.91,11.94
N$3
  Top 0.152: C11.1 23.17,18.47 25.46,18.47 26.14,19.15 Y1.P$2 26.22,19.23 26.75,19.76 | 30.34,19.76 U3.6
  Top 0.203: 26.75,19.76 30.34,19.76
N$4
  Top 0.152: C10.1 23.17,24.11 25,24.11 26.14,22.96 Y1.P$1 26.3,22.89 | 30.34,20.3 U3.5
  Top 0.203: 30.34,20.3 28.89,20.3 26.3,22.89
N$5  (via drill 0.33)
  Top 0.152: 40.01,40.49 C17.1 | 39.55,38.58 C16.+
  Top 0.203: U4.34 42.9,38.12 v42.42,38.61 | v40.64,38.61 C16.+
  Top 0.305: 40.01,40.49 40.01,39.65 C16.+
  Bottom 0.203: v42.42,38.61 v40.64,38.61
N$6  (via drill 0.33)
  Top 0.203: 54.53,39.51 54.79,39.46 | 54.79,39.46 C15.+ | v52.83,40.64 53.5,41.17 54.42,41.17 C14.1 54.5,39.75 54.79,39.46 | U4.5 52.01,38.92 v52.83,38.1
  Bottom 0.203: v52.83,38.1 v52.83,40.64
N$7
  Top 0.152: X2.D+ 31.24,42.51 R21.2
N$8
  Top 0.305: U3.47 44.65,21.79 C13.1
N$9
  Top 0.305: U1.5 9.98,30.82 10.96,29.84 10.96,27.51 L1.1
N$10
  Top 0.152: X2.D- 31.89,42.11 R22.2
N$11
  Top 0.203: U1.3 7.94,33.09 7.62,32.77 2.79,32.77 SW1.2
N$12
  Top 0.152: X2.ID 30.59,44.56 29.72,43.69 R23.2
N$14  (via drill 0.33)
  Top 0.152: U2.5 22.11,35.61 22.11,35.55 22.87,35.55 v23.88,34.54 | 22.56,31.95 R5.2 23.11,32 v23.88,32.77
  Bottom 0.152: v23.88,32.77 v23.88,34.54
N$15
  Top 0.61: X2.VBUS 32.54,45.52 L3.1
N$16
  Top 0.152: U2.12 21.59,43.6 R7.2
N$17
  Top 0.152: U2.13 21.08,44.36 R6.2
N$18
  Top 0.152: R12.2 R11.2 71.88,24.64 72.64,23.88 72.64,15.53 R18.1
N$19
  Top 0.152: R17.1 61.63,18.68 U5.4
N$20
  Top 0.152: U5.3 64.44,16.33 65.02,15.75 65.02,13.88 R16.1
N$22  (via drill 0.33)
  Top 0.152: R15.2 R19.2 56.04,13.34 v57.78,15.08
  Bottom 0.152: v57.78,15.08 57.66,15.21 57.66,19.56 60.96,22.86 65.02,22.86 65.53,23.37 65.53,32.16 X1.3
NRST  (via drill 0.33)
  Top 0.152: v34.54,18.03 33.29,19.29 U3.7 30.16,19.37 28.51,19.37 26.92,17.78 25.57,17.78 R9.1 | v43.18,17.78 SWD.5 | v37.08,18.03 40.13,18.03 v40.39,17.78
  Bottom 0.152: v34.54,18.03 v37.08,18.03 | v40.39,17.78 v43.18,17.78
OUT_L
  Top 0.152: 62.03,28.75 C30.+ | 67.44,26.92 67.44,26.7 R20.1 67.44,26.92
  Top 0.203: 63.02,29.74 63.02,31.22 61.47,32.77 R14.2 | 62.03,28.75 63.02,29.74 | 67.44,26.92 R11.1 | 63.02,29.74 66.67,29.74 | 66.67,29.74 66.67,27.66 R20.1 | 66.67,29.74 66.67,30.8 X1.2
OUT_R
  Top 0.152: 67.44,41.48 X1.5
  Top 0.203: 63.02,41.48 63.02,41.45 61.47,39.9 R13.2 | 67.44,41.48 63.02,41.48 | R12.1 69.76,27.09 69.85,27.18 69.85,39.68 X1.5 | 63.02,41.48 63.02,44.2 C29.+
SD_CD  (via drill 0.33)
  Top 0.152: v17.27,23.18 16.41,22.32 U6.CD1 | 30.16,20.8 U3.4 30.28,20.83 29.46,20.83 29.21,21.08 v28.96,21.08
  Bottom 0.152: v17.27,23.18 26.86,23.18 v28.96,21.08
SD_CS  (via drill 0.33)
  Top 0.152: v29.21,18.41 29.37,18.26 30.16,18.26 U3.9 | 5.56,16.35 U6.2 6.28,16.22 v7.84,16.22 | R26.2 19.9,14.82 v20.07,14.99
  Bottom 0.152: v7.84,16.22 20.32,16.22 | 20.32,16.22 28.19,16.22 29.21,17.24 v29.21,18.41 | v20.07,14.99 20.07,15.97 20.32,16.22
SD_MISO  (via drill 0.33)
  Top 0.152: v28.26,17.94 28.42,17.78 30.16,17.78 U3.10 | v7.11,20.95 6.22,21.84 6,21.84 U6.7 | R25.2 15.66,20.15 v15.49,20.07
  Bottom 0.152: v28.26,17.94 25.24,20.95 14.99,20.95 | v7.11,20.95 14.99,20.95 | v15.49,20.07 15.49,20.45 14.99,20.95
SD_MOSI  (via drill 0.33)
  Top 0.152: v26.7,17.11 26.89,17.3 30.16,17.3 U3.11 | 5.24,17.46 U6.3 5.8,17.4 v8.03,17.4 | R24.2 17.44,16.85 v16,18.29
  Bottom 0.152: v26.7,17.11 26.42,17.4 15.24,17.4 | v8.03,17.4 15.24,17.4 | v16,18.29 16,18.16 15.24,17.4
SD_SCK  (via drill 0.33)
  Top 0.152: v38.26,10.48 38.26,12.7 U3.29 | v7.11,19.62 5.17,19.62 5.08,19.53 U6.5
  Bottom 0.152: v38.26,10.48 35.18,13.56 8.29,13.56 7.11,14.73 v7.11,19.62
SPK+  (via drill 0.33)
  Top 0.305: U5.5 59.08,17.63 v58.93,17.78
  Bottom 0.305: v58.93,17.78 58.93,18.29 59.18,18.54 61.72,18.54 62.23,18.03 JP1.1
SPK-
  Top 0.305: U5.8 59.08,3.15 JP1.2
SPK_IN
  Top 0.152: R17.2 64.01,19.81 67.06,16.76 70.87,16.76 R18.2
SWD_CLK
  Top 0.152: SWD.2 43.89,25.4 42.82,24.33 39.85,24.33 U3.49
SWD_DATA
  Top 0.152: U3.46 42.37,21.29 42.42,21.34 49.78,21.34 SWD.4
USB_DM  (via drill 0.33)
  Top 0.152: 41.92,20.3 U3.44 41.85,20.32 v43.69,20.32 | R22.1 32.62,39.71 32.62,38.5 v32.77,38.35
  Bottom 0.152: v32.77,38.35 32.77,32 43.69,21.08 v43.69,20.32
USB_DP  (via drill 0.33)
  Top 0.152: U3.45 41.92,20.83 v40.39,20.83 | R21.1 v30.23,38.35
  Bottom 0.152: v30.23,38.35 30.23,33.53 40.39,23.37 v40.39,20.83
USB_ID  (via drill 0.33)
  Top 0.152: U3.43 40.15,19.79 v39.88,20.07 | v25.4,43.69 R23.1
  Bottom 0.152: v39.88,20.07 39.62,20.07 24.13,35.56 24.13,42.42 v25.4,43.69
VBAT+
  Top 0.305: 18.8,38.86 18.92,38.86 U2.16 19.3,38.68 19.3,39.12 19.66,39.47 U2.15 | U2.14 U2.15 | U2.15 20.09,40.51 C4.+ | R1.2 14.73,38.86
  Top 0.61: 18.8,38.86 14.73,38.86 11.43,38.86 8.89,41.4 CN1.1
VCC
  Top 0.305: U2.20 19.21,36.53 19.21,36.22 | C1.+ 10.43,36.53 10.03,36.53 | 9.98,36.08 C1.+ | 19.21,36.22 19.21,35.91 19.3,35.81 19.99,35.81 U2.1 | 9.84,35.39 9.84,37.15 8.89,38.1 5.62,38.1 SW1.1 | 19.21,36.22 19.28,36.22 19.05,36.32 | 10.59,36.32 10.59,36.3 C1.+
  Top 0.406: 9.84,35.39 C1.+
  Top 0.61: U1.1 9.84,35.39 | 19.05,36.32 10.59,36.32 10.41,36.32
VIN  (via drill 0.33)
  Top 0.152: 33.43,37.34 33.43,36.42 v33.53,36.32 | U3.42 44.18,19.29 v44.45,19.56
  Top 0.203: 19.46,37.59 U2.18 19.18,37.59 | 18.83,33.66 18.83,32 | 18.83,32 18.83,31.95 | R3.1 18.83,32
  Top 0.305: U2.4 21.59,34.04 22,33.66 | U2.19 U2.18 U2.17
  Top 0.61: U2.18 v17.78,37.59 | v17.78,35.31 17.78,34.7 18.83,33.66 22,33.66 25.56,33.66 27.08,35.18 27.08,36.62 C3.+ 27.54,37.34 33.43,37.34 34.45,38.35 34.45,41.71 L3.2 34.63,41.91 35.9,41.91 39.37,45.38 JP4.2
  Bottom 0.152: v44.45,19.56 44.45,21.34 33.53,32.26 v33.53,36.32
  Bottom 0.61: v17.78,37.59 v17.78,35.31
VPCC  (via drill 0.33)
  Top 0.152: U2.2 20.57,34.8 v20.32,34.54 | v17.53,33.78 17.53,31.84 R3.2
  Top 0.203: R4.1 R3.2
  Bottom 0.152: v20.32,34.54 18.29,34.54 v17.53,33.78

### Text on the board
tPlace: La boîte à musique
tNames: 5V | GND | 3V3 | GND | 3V3 | CLK | GND | DAT | RST | TX | RX | - | + | GND
bNames: rev0 2015-05-14